# EAGLE design Home Assistant Relay 8 Channel V1.2 (EAGLE 6.1)

## Sheet 1 of 2
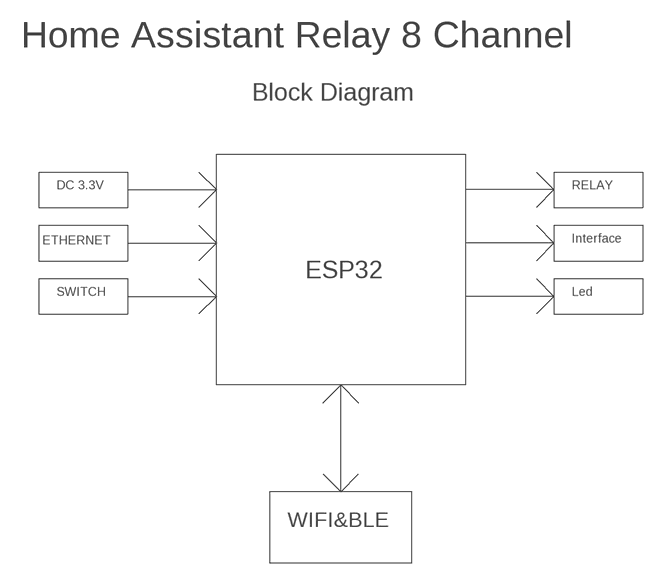
[diagram p0: schematic, sheet 1]

### Notes on the sheet
- Home Assistant Relay 8 Channel
- Block Diagram
- DC 3.3V | RELAY
- ETHERNET | Interface
- ESP32
- SWITCH | Led
- WIFI&BLE

## Sheet 2 of 2
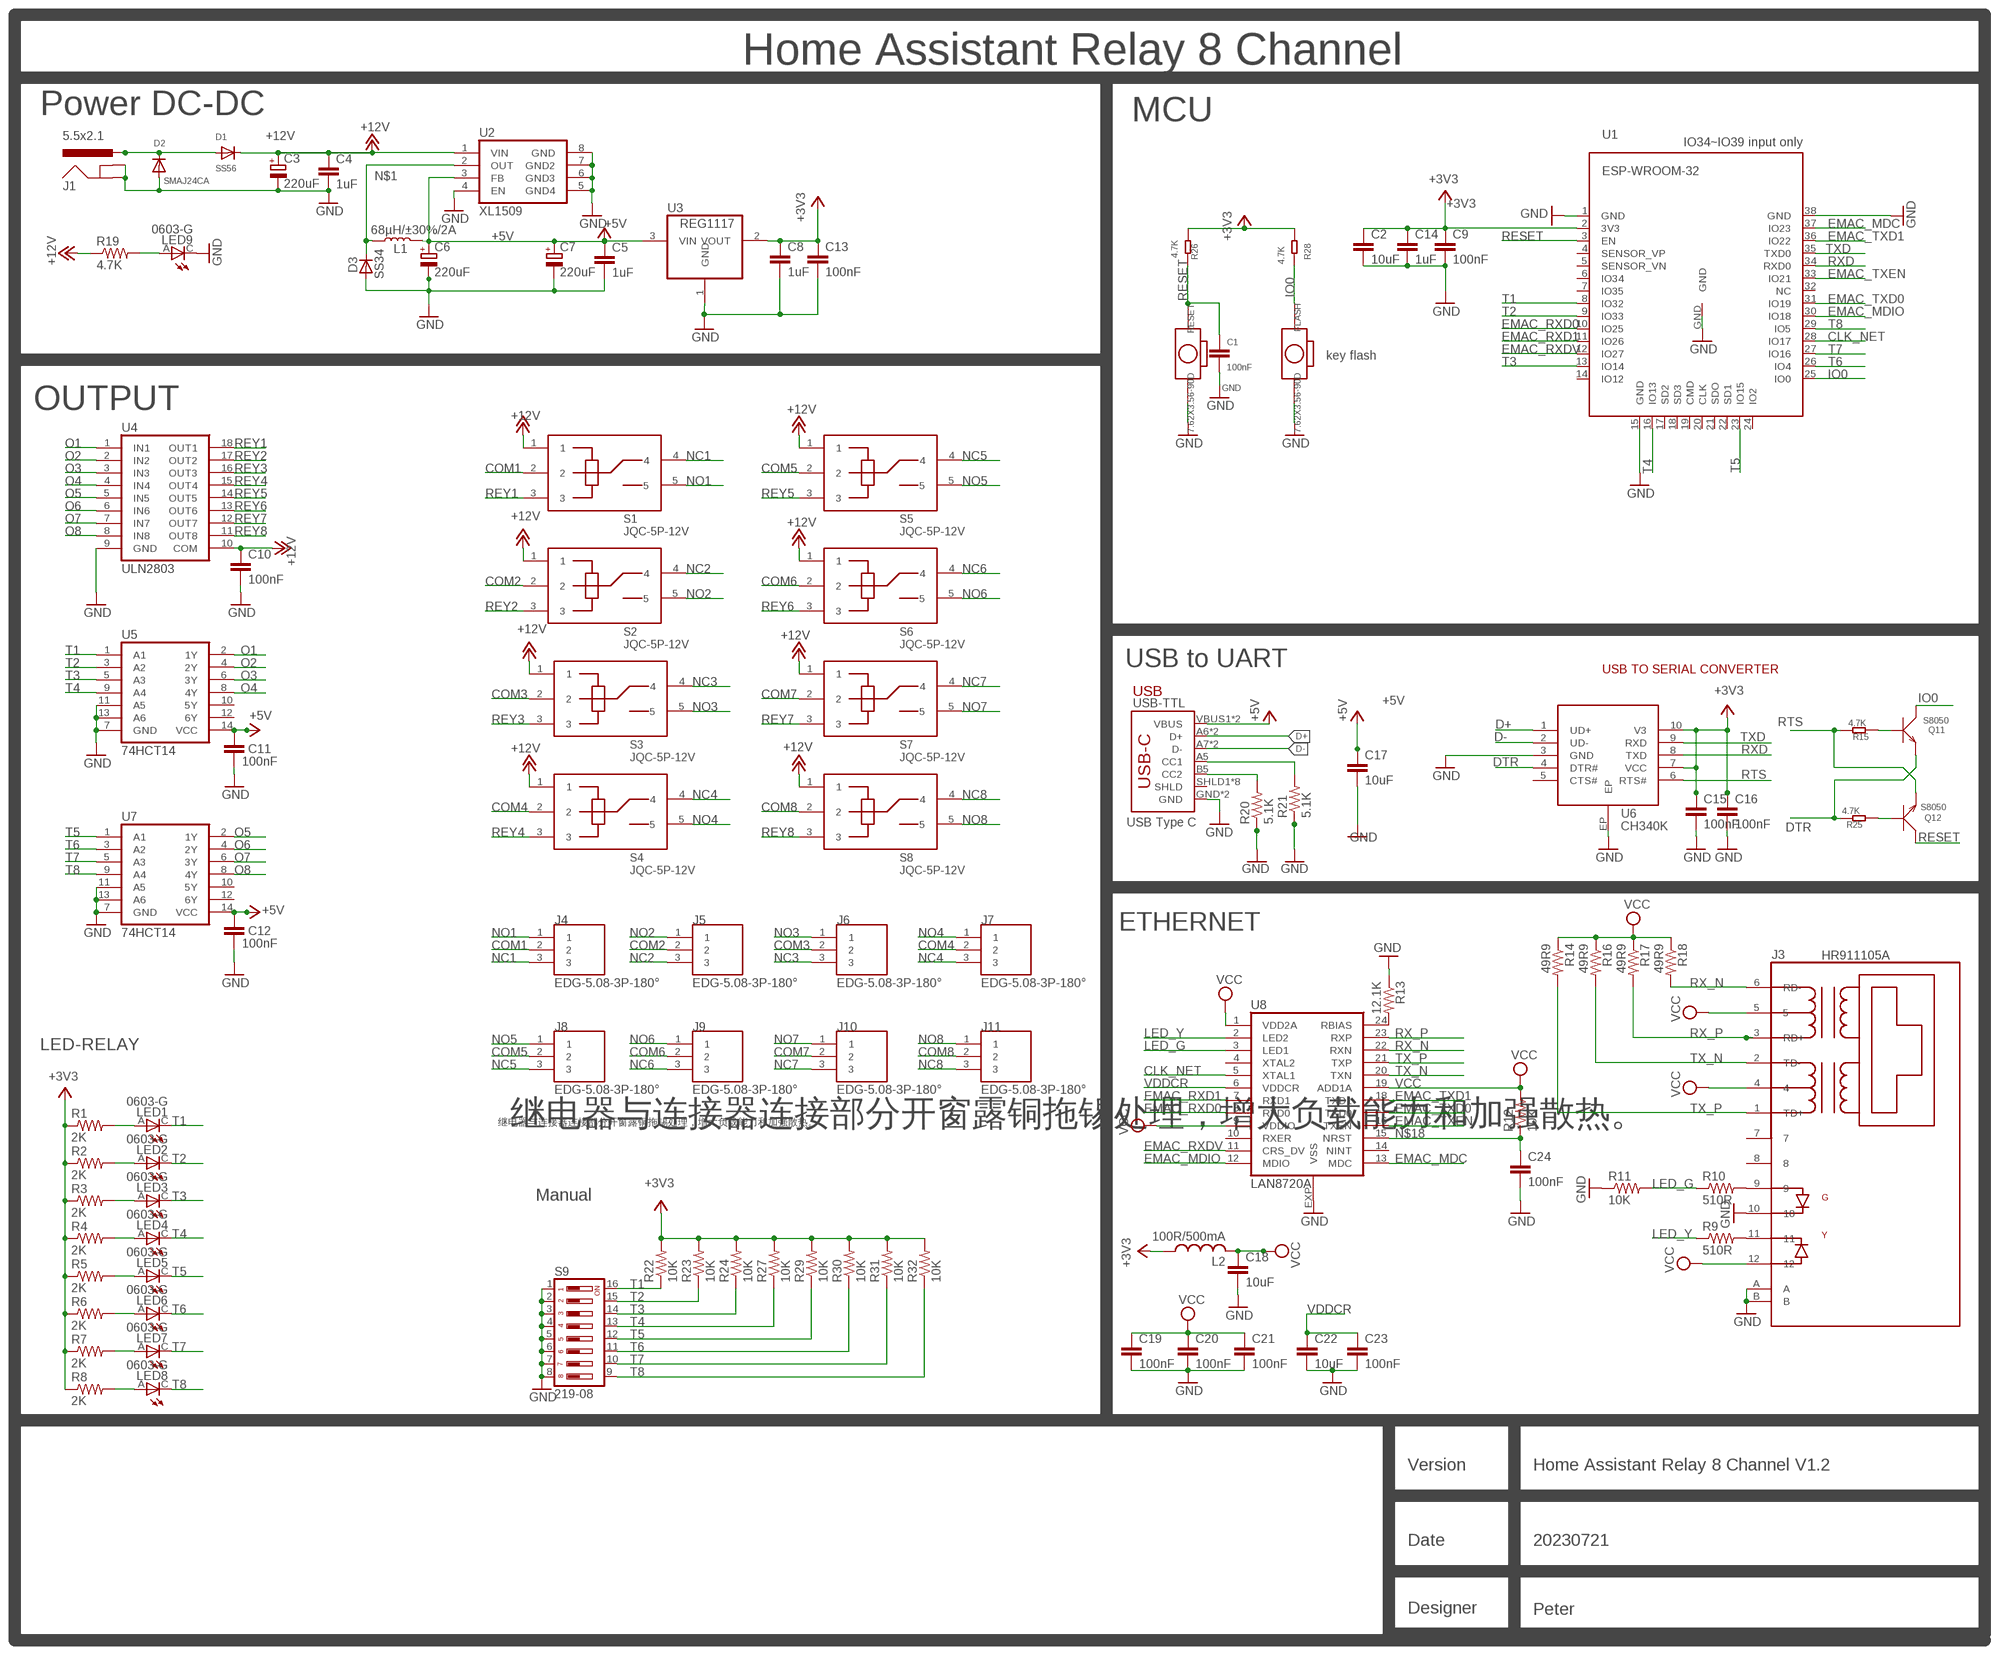
[diagram p1: schematic, sheet 2]

### Parts
C1  100nF  C0603  [C0603]
C2  10uF  C0603  [C0603]
C3  220uF  C-6.35  [SMD-6.3*5]
C4  1uF  C0603  [C0603]
C5  1uF  C0603  [C0603]
C6  220uF  C-6.35  [SMD-6.3*5]
C7  220uF  C-6.35  [SMD-6.3*5]
C8  1uF  C0603  [C0603]
C9  100nF  C0603  [C0603]
C10  100nF  C0603  [C0603]
C11  100nF  C0603  [C0603]
C12  100nF  C0603  [C0603]
C13  100nF  C0603  [C0603]
C14  1uF  C0603  [C0603]
C15  100nF  C0603  [C0603]
C16  100nF  C0603  [C0603]
C17  10uF  C0603  [C0603]
C18  10uF  C0603  [C0603]
C19  100nF  C0603  [C0603]
C20  100nF  C0603  [C0603]
C21  100nF  C0603  [C0603]
C22  10uF  C0603  [C0603]
C23  100nF  C0603  [C0603]
C24  100nF  C0603  [C0603]
D1  SS56  D-DO214  [DO-214]
D2  SMAJ24CA  D-DO214  [DO-214]
D3  SS34  DIODE-DO-214AC  [DO-214AC]
FLASH  7.62X3.56-90D  KEY-2P-7.62X3.56-90D  [2P-7.62X3.56-90D]
J1  5.5x2.1  POWER_JACKSMD  [POWER_JACK_SMD]
J3  HR911105A  [HR911105A]
J4  EDG-5.08-3P-180°  [EDG5.08MM-3P-180°]
J5  EDG-5.08-3P-180°  [EDG5.08MM-3P-180°]
J6  EDG-5.08-3P-180°  [EDG5.08MM-3P-180°]
J7  EDG-5.08-3P-180°  [EDG5.08MM-3P-180°]
J8  EDG-5.08-3P-180°  [EDG5.08MM-3P-180°]
J9  EDG-5.08-3P-180°  [EDG5.08MM-3P-180°]
J10  EDG-5.08-3P-180°  [EDG5.08MM-3P-180°]
J11  EDG-5.08-3P-180°  [EDG5.08MM-3P-180°]
L1  68µH/±30%/2A  INDUCTOR-CR54-3.3UH  [CR54]
L2  100R/500mA  L0603  [R0603]
LED1  0603-G  LED0603  [LED0603]
LED2  0603-G  LED0603  [LED0603]
LED3  0603-G  LED0603  [LED0603]
LED4  0603-G  LED0603  [LED0603]
LED5  0603-G  LED0603  [LED0603]
LED6  0603-G  LED0603  [LED0603]
LED7  0603-G  LED0603  [LED0603]
LED8  0603-G  LED0603  [LED0603]
LED9  0603-G  LED0603  [LED0603]
Q11  S8050  TRANSISTOR-NPN-SOT23  [SOT23]
Q12  S8050  TRANSISTOR-NPN-SOT23  [SOT23]
R1  2K  R0603  [R0603]
R2  2K  R0603  [R0603]
R3  2K  R0603  [R0603]
R4  2K  R0603  [R0603]
R5  2K  R0603  [R0603]
R6  2K  R0603  [R0603]
R7  2K  R0603  [R0603]
R8  2K  R0603  [R0603]
R9  510R  R0603  [R0603]
R10  510R  R0603  [R0603]
R11  10K  R0603  [R0603]
R12  10K  R0603  [R0603]
R13  12.1K  R0603  [R0603]
R14  49R9  R0603  [R0603]
R15  4.7K  R-0603  [R0603]
R16  49R9  R0603  [R0603]
R17  49R9  R0603  [R0603]
R18  49R9  R0603  [R0603]
R19  4.7K  R0603  [R0603]
R20  5.1K  R0603  [R0603]
R21  5.1K  R0603  [R0603]
R22  10K  R0603  [R0603]
R23  10K  R0603  [R0603]
R24  10K  R0603  [R0603]
R25  4.7K  R-0603  [R0603]
R26  4.7K  R-0603  [R0603]
R27  10K  R0603  [R0603]
R28  4.7K  R-0603  [R0603]
R29  10K  R0603  [R0603]
R30  10K  R0603  [R0603]
R31  10K  R0603  [R0603]
R32  10K  R0603  [R0603]
RESET  7.62X3.56-90D  KEY-2P-7.62X3.56-90D  [2P-7.62X3.56-90D]
S1  JQC-5P-12V  JQC-5P-3.3V  [JQC-5P-5V]
S2  JQC-5P-12V  JQC-5P-3.3V  [JQC-5P-5V]
S3  JQC-5P-12V  JQC-5P-3.3V  [JQC-5P-5V]
S4  JQC-5P-12V  JQC-5P-3.3V  [JQC-5P-5V]
S5  JQC-5P-12V  JQC-5P-3.3V  [JQC-5P-5V]
S6  JQC-5P-12V  JQC-5P-3.3V  [JQC-5P-5V]
S7  JQC-5P-12V  JQC-5P-3.3V  [JQC-5P-5V]
S8  JQC-5P-12V  JQC-5P-3.3V  [JQC-5P-5V]
S9  219-08  [CTS-219-08]
U1  ESP-WROOM-32  [ESP-WROOM-32]
U2  XL1509  [SOP8]
U3  REG1117  [SOT223]
U4  ULN2803  [MSOP18]
U5  74HCT14  [SO14]
U6  CH340K  [ESOP-10-EP-150MIL]
U7  74HCT14  [SO14]
U8  LAN8720A  [QFN24-4X4]
USB-TTL  USB_C5  [USB-C-16P-5]

### Nets
+3V3: C2.1 C8.1 C9.1 C13.1 C14.1 C15.1 C16.1 L2.1 R1.1 R2.1 R3.1 R4.1 R5.1 R6.1 R7.1 R8.1 R22.2 R23.2 R24.2 R26.2 R27.2 R28.2 R29.2 R30.2 R31.2 R32.2 U1.2(3V3) U3.2(VOUT) U6.7(VCC) U6.10(V3)
+5V: C5.1 C6.+ C7.+ C11.1 C12.1 C17.1 L1.P$2 U2.3(FB) U3.3(VIN) U5.14(VCC) U7.14(VCC) USB-TTL.VBUS1(VBUS) USB-TTL.VBUS2(VBUS)
+12V: C3.+ C4.1 C10.1 D1.C R19.1 S1.1 S2.1 S3.1 S4.1 S5.1 S6.1 S7.1 S8.1 U2.1(VIN) U4.10(COM)
CLK_NET: U1.28(IO17) U8.5(XTAL1)
COM1: J4.2 S1.2
COM2: J5.2 S2.2
COM3: J6.2 S3.2
COM4: J7.2 S4.2
COM5: J8.2 S5.2
COM6: J9.2 S6.2
COM7: J10.2 S7.2
COM8: J11.2 S8.2
D+: U6.1(UD+) USB-TTL.A6(D+) USB-TTL.B6(D+)
D-: U6.2(UD-) USB-TTL.A7(D-) USB-TTL.B7(D-)
DTR: Q11.2(E) R25.1 U6.4(DTR#)
EMAC_MDC: U1.37(IO23) U8.13(MDC)
EMAC_MDIO: U1.30(IO18) U8.12(MDIO)
EMAC_RXD0: U1.10(IO25) U8.8(RXD0)
EMAC_RXD1: U1.11(IO26) U8.7(RXD1)
EMAC_RXDV: U1.12(IO27) U8.11(CRS_DV)
EMAC_TXD0: U1.31(IO19) U8.17(TXD0)
EMAC_TXD1: U1.36(IO22) U8.18(TXD1)
EMAC_TXEN: U1.33(IO21) U8.16(TXEN)
GND: C1.2 C2.2 C3.- C4.2 C5.2 C6.- C7.- C8.2 C9.2 C10.2 C11.2 C12.2 C13.2 C14.2 C15.2 C16.2 C17.2 C18.2 C19.2 C20.2 C21.2 C22.2 C23.2 C24.2 D2.A D3.A FLASH.P$2 J1.GND(GNDBREAK) J1.P$4(GND) J3.10 J3.A J3.B LED9.C R11.1 R13.1 R20.1 R21.1 RESET.P$2 S9.1 S9.2 S9.3 S9.4 S9.5 S9.6 S9.7 S9.8 U1.1(GND) U1.15(GND) U1.38(GND) U1.GND U2.4(EN) U2.5(GND4) U2.6(GND3) U2.7(GND2) U2.8(GND) U3.1(GND) U4.9(GND) U5.7(GND) U5.11(A5) U5.13(A6) U6.3(GND) U6.EP U7.7(GND) U7.11(A5) U7.13(A6) U8.EXP(VSS) USB-TTL.GND USB-TTL.GND2(GND)
IO0: FLASH.P$1 Q11.3(C) R28.1 U1.25(IO0)
LED_G: R10.1 R11.2 U8.3(LED1)
LED_Y: R9.1 U8.2(LED2)
N$1: D3.C L1.P$1 U2.2(OUT)
N$2: LED1.A R1.2
N$4: LED2.A R2.2
N$5: LED3.A R3.2
N$6: LED4.A R4.2
N$7: LED5.A R5.2
N$8: Q12.1(B) R25.2
N$9: Q11.1(B) R15.2
N$11: LED6.A R6.2
N$12: LED7.A R7.2
N$13: LED8.A R8.2
N$14: J3.11 R9.2
N$15: J3.9 R10.2
N$17: R13.2 U8.24(RBIAS)
N$18: C24.1 R12.1 U8.15(NRST)
N$19: D1.A D2.C J1.VIN0(PWR)
N$20: LED9.A R19.2
N$21: R21.2 USB-TTL.A5(CC1)
N$22: R20.2 USB-TTL.B5(CC2)
NC1: J4.3 S1.4
NC2: J5.3 S2.4
NC3: J6.3 S3.4
NC4: J7.3 S4.4
NC5: J8.3 S5.4
NC6: J9.3 S6.4
NC7: J10.3 S7.4
NC8: J11.3 S8.4
NO1: J4.1 S1.5
NO2: J5.1 S2.5
NO3: J6.1 S3.5
NO4: J7.1 S4.5
NO5: J8.1 S5.5
NO6: J9.1 S6.5
NO7: J10.1 S7.5
NO8: J11.1 S8.5
O1: U4.1(IN1) U5.2(1Y)
O2: U4.2(IN2) U5.4(2Y)
O3: U4.3(IN3) U5.6(3Y)
O4: U4.4(IN4) U5.8(4Y)
O5: U4.5(IN5) U7.2(1Y)
O6: U4.6(IN6) U7.4(2Y)
O7: U4.7(IN7) U7.6(3Y)
O8: U4.8(IN8) U7.8(4Y)
RESET: C1.1 Q12.3(C) R26.1 RESET.P$1 U1.3(EN)
REY1: S1.3 U4.18(OUT1)
REY2: S2.3 U4.17(OUT2)
REY3: S3.3 U4.16(OUT3)
REY4: S4.3 U4.15(OUT4)
REY5: S5.3 U4.14(OUT5)
REY6: S6.3 U4.13(OUT6)
REY7: S7.3 U4.12(OUT7)
REY8: S8.3 U4.11(OUT8)
RTS: Q12.2(E) R15.1 U6.6(RTS#)
RX_N: J3.6(RD-) R18.2 U8.22(RXN)
RX_P: J3.3(RD+) R17.2 U8.23(RXP)
RXD: U1.34(RXD0) U6.8(TXD)
T1: LED1.C R22.1 S9.16 U1.8(IO32) U5.1(A1)
T2: LED2.C R23.1 S9.15 U1.9(IO33) U5.3(A2)
T3: LED3.C R24.1 S9.14 U1.13(IO14) U5.5(A3)
T4: LED4.C R27.1 S9.13 U1.16(IO13) U5.9(A4)
T5: LED5.C R29.1 S9.12 U1.23(IO15) U7.1(A1)
T6: LED6.C R30.1 S9.11 U1.26(IO4) U7.3(A2)
T7: LED7.C R31.1 S9.10 U1.27(IO16) U7.5(A3)
T8: LED8.C R32.1 S9.9 U1.29(IO5) U7.9(A4)
TX_N: J3.2(TD-) R16.2 U8.20(TXN)
TX_P: J3.1(TD+) R14.2 U8.21(TXP)
TXD: U1.35(TXD0) U6.9(RXD)
VCC: C18.1 C19.1 C20.1 C21.1 J3.4 J3.5 J3.12 L2.2 R12.2 R14.1 R16.1 R17.1 R18.1 U8.1(VDD2A) U8.9(VDDIO) U8.19(ADD1A)
VDDCR: C22.1 C23.1 U8.6(VDDCR)
Unconnected: J3.7 J3.8 U1.4(SENSOR_VP) U1.5(SENSOR_VN) U1.6(IO34) U1.7(IO35) U1.14(IO12) U1.17(SD2) U1.18(SD3) U1.19(CMD) U1.20(CLK) U1.21(SDO) U1.22(SD1) U1.24(IO2) U1.32(NC) U5.10(5Y) U5.12(6Y) U6.5(CTS#) U7.10(5Y) U7.12(6Y) U8.4(XTAL2) U8.10(RXER) U8.14(NINT) USB-TTL.SHLD1(SHLD) USB-TTL.SHLD2(SHLD) USB-TTL.SHLD3(SHLD) USB-TTL.SHLD4(SHLD) USB-TTL.SHLD5(SHLD) USB-TTL.SHLD6(SHLD) USB-TTL.SHLD7(SHLD) USB-TTL.SHLD8(SHLD)

### Notes on the sheet
- Home Assistant Relay 8 Channel
- Power DC-DC | MCU
- IO34~IO39 input only
- key flash
- OUTPUT
- USB to UART
- USB TO SERIAL CONVERTER
- USB
- USB Type C
- ETHERNET
- LED-RELAY
- 继电器与连接器连接部分开窗露铜拖锡处理，增大负载能力和加强散热。 | 继电器与连接器连接部分开窗露铜拖锡处理，增大负载能力和加强散热。
- Manual
- Version | Home Assistant Relay 8 Channel V1.2
- Date | 20230721
- Designer | Peter

## Library data of the parts
C1 C2 C4 C5 C8-C24 = Makerfabs-Peter:C0603
C3 C6 C7 = Makerfabs-Peter:C-6.3*5
D1 D2 = Makerfabs-Peter:D-DO214
D3 = diode:DIODE-: DIODE
FLASH RESET = Makerfabs-Peter:KEY-2P-7.62X3.56-90D
J1 = SparkFun-Connectors:POWER_JACK: Power Jack Connector This is the standard 5.5mm barrel jack for power. The PTH is the most common, proven, reliable, footprint. The Slot footprint only works if the mill layer is transmitted to the PCB fab house so be warned. Here are the connectors we sell at SparkFun: DC Barrel Power Jack/Connector <https://www.sparkfun.com/products/119> (PRT-00119) DC Barrel Power Jack/Connector (SMD) <https://www.sparkfun.com/products/12748> (PRT-12748) DC Barrel Jack Adapter - Breadboard Compatible <https://www.sparkfun.com/products/10811> (PRT-10811) It is used on this SparkFun product (and many, many others): SparkFun RedBoard - Programmed with Arduino <https://www.sparkfun.com/products/12757> (DEV-12757) Also, if you need a mating power supply or connector, please check these out: Wall Adapter Power Supply - 9VDC 650mA <https://www.sparkfun.com/products/298> (TOL-00298) DC Barrel Jack Adapter - Male <https://www.sparkfun.com/products/10287> (PRT-10287); PROD_ID: CONN-08106; SF_ID: PRT-12748; VALUE: 5.5x2.1mm Barrel
J3 = Makerfabs-Peter:HR911105A
J4-J11 = Makerfabs-Peter:EDG-5.08-3P-180°
L1 = SparkFun-Coils:INDUCTOR: Inductors Resist changes in electrical current. Basically a coil of wire. SparkFun Products: SparkFun Load Cell Amplifier - HX711 <https://www.sparkfun.com/products/13879> IOIO-OTG - V2.2 <https://www.sparkfun.com/products/13613>; PROD_ID: NDUC-11157; VALUE: 3.3µH/±30%/3.4A
L2 = Makerfabs-Peter:L0603
LED1-LED9 = Makerfabs-Peter:LED0603
Q11 Q12 = Discrete:TRANSISTOR-NPN*: NPN audion
R1-R14 R16-R24 R27 R29-R32 = Makerfabs-Peter:R0603
R15 R25 R26 R28 = Discrete:R*
S1-S8 = Makerfabs-Peter:JQC-5P-3.3V
S9 = Makerfabs-Peter:219-08*: Surface Mount DIP Switch Series 219 SMT CTS Electronic Components Sourc: www.ctscorp.com; OC_FARNELL: unknown; OC_NEWARK: unknown
U1 = esp32:ESP-WROOM-32
U2 = Makerfabs-Peter:XL1509
U3 = burr-brown:REG1117: 800mA and 1A Low Dropout (LDO) Positive Regulator 1.8V, 2.5V, 2.85V, 3.3V, 5V, and Adj; MPN: REG1117; OC_FARNELL: 1097566; OC_NEWARK: 14P6981
U4 = Makerfabs-Peter:ULN2803
U5 U7 = Makerfabs-Peter:74HCT14
U6 = sale:CH340K
U8 = Makerfabs-Peter:LAN8720A
USB-TTL = USBC:USB_C: USB Type C 16Pin Connector Super Speed pins not available on the 16-pin purely SMD connector so this part is best for USB 2.0 implementations. D1 and D2 are tied together enabling D+/- no matter which way the cable is plugged into the connector. The two channel configuration pins (CC1/2) are exposed. These are normally connected to ground via 5.1k resistors but can be reconfigured for high current/high power applications.

## Net classes
0 default: width 0.152 mm, drill 0.254 mm, clearance 0.152 mm

## Board
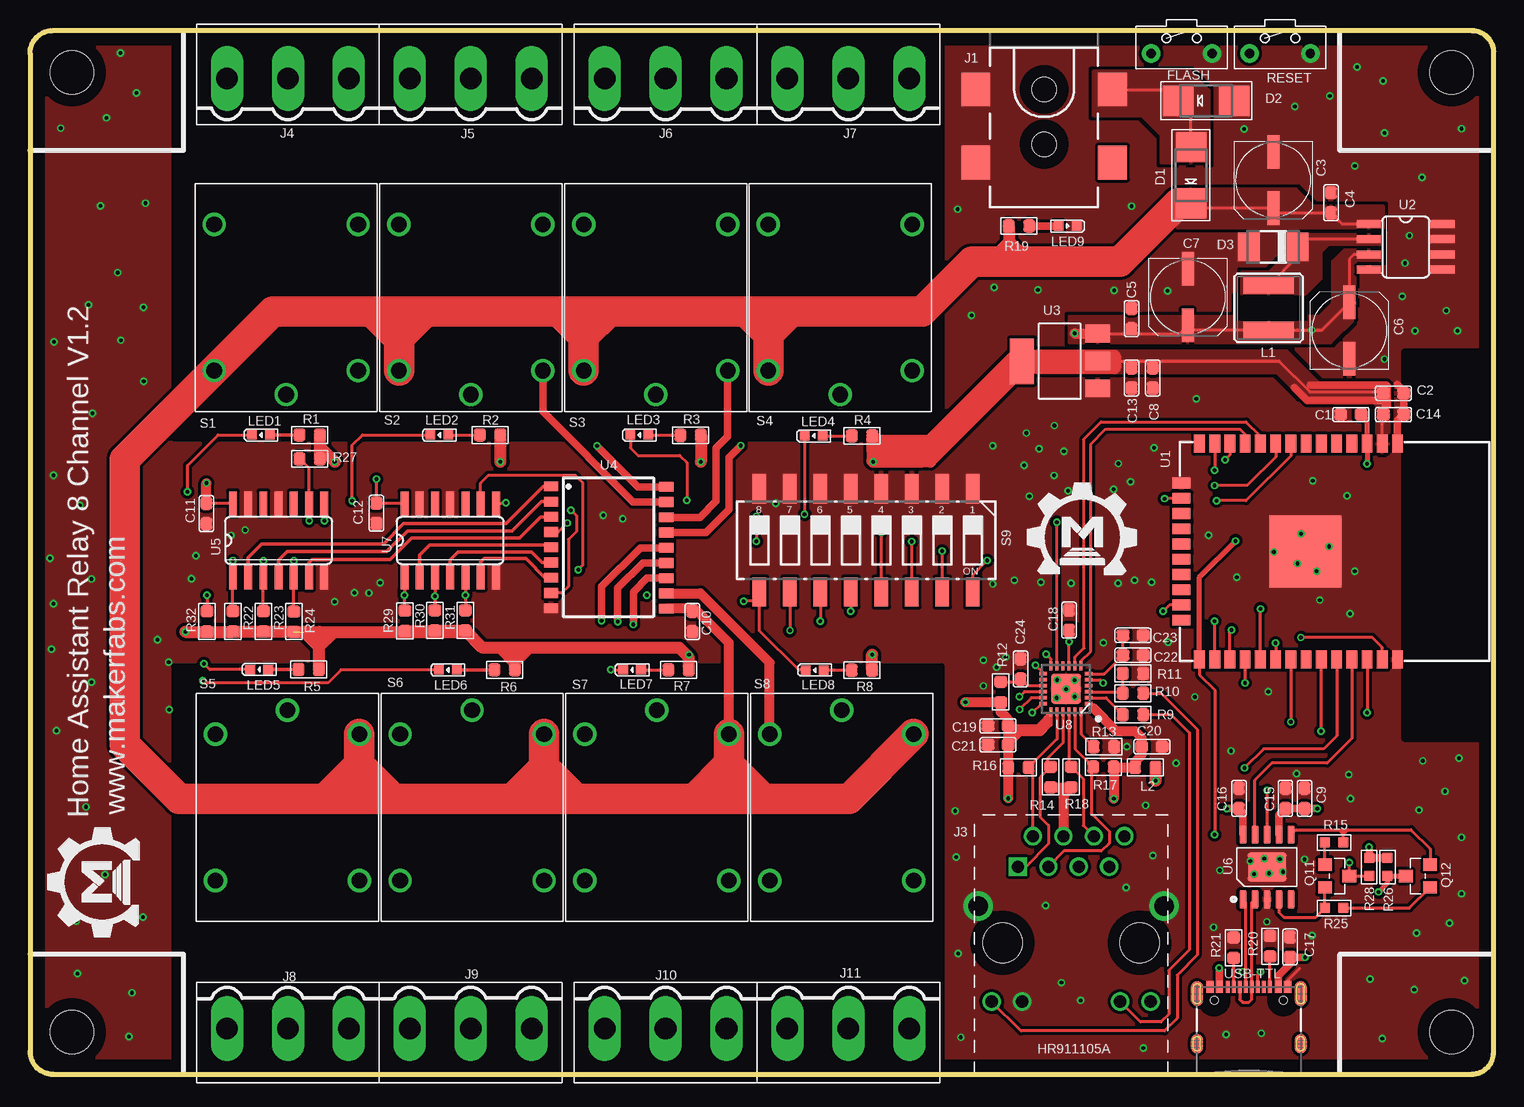
[diagram p2: board, top side]
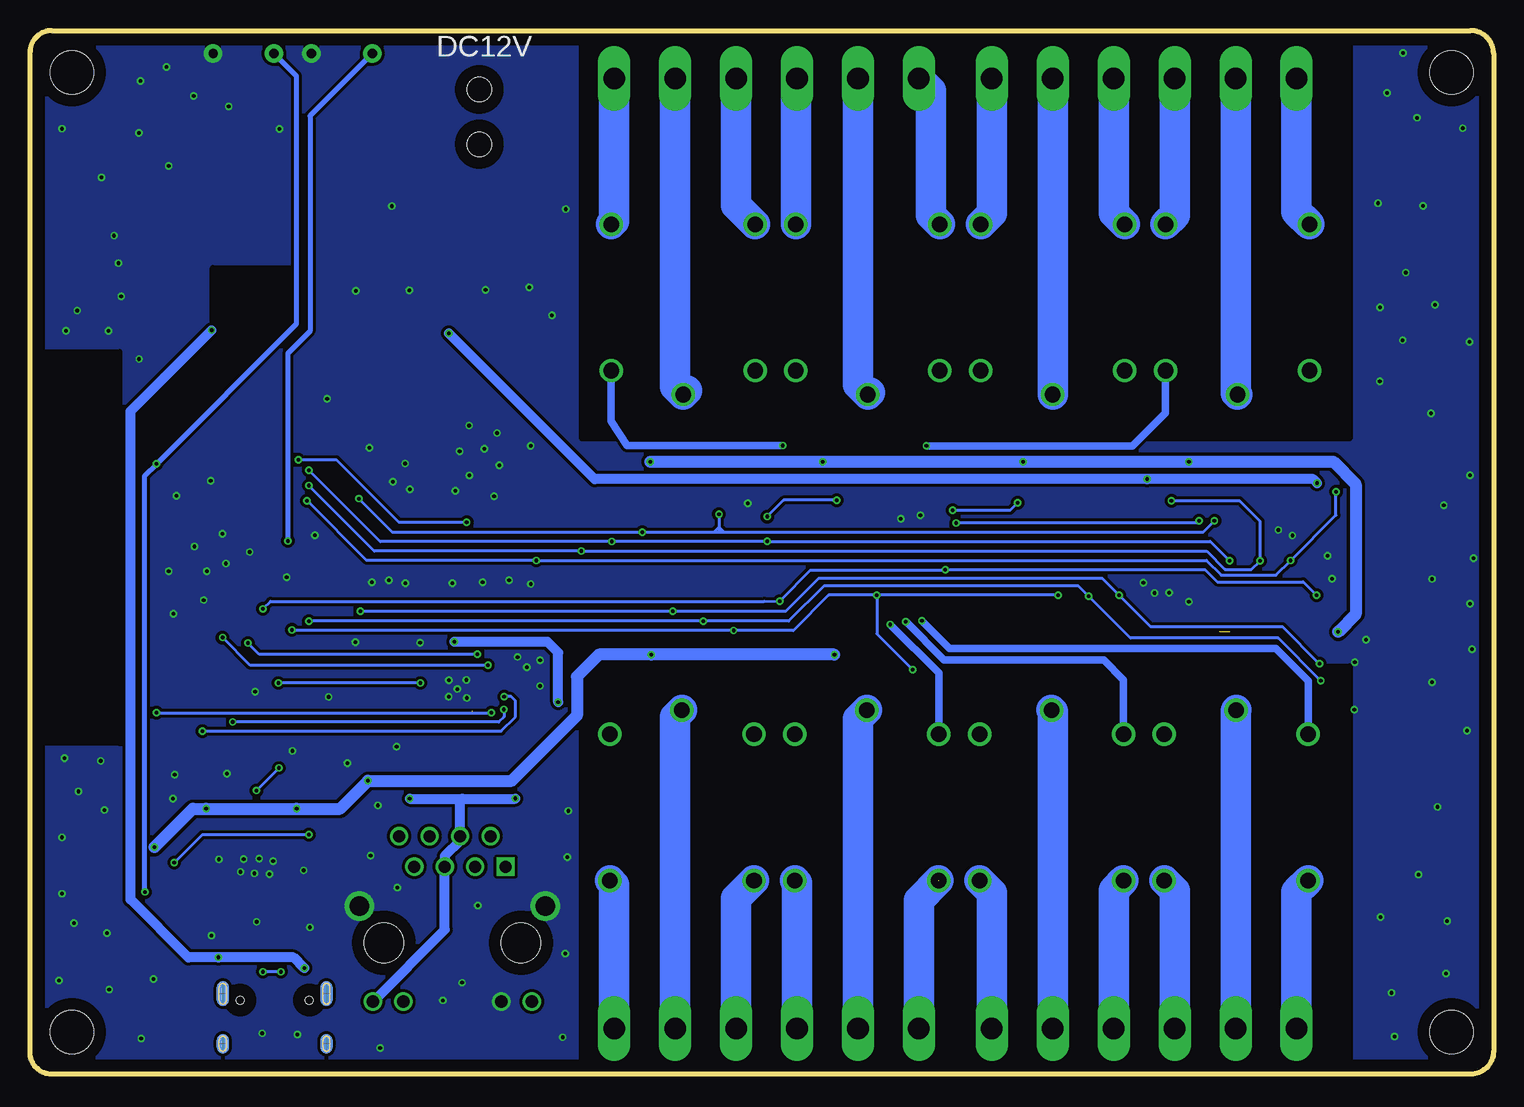
[diagram p3: board, bottom side, seen from below]

Size 122 x 87 mm. Coordinates in mm from the lower left corner, seen from the top.
Outline: 1.9,0 120.2,0 arc90 122,1.8 122,85.2 arc90 120.2,87 1.9,87 arc90 0,85.1 0,1.9 arc90 1.9,0
Copper layers (1*16): Top 0.035mm / dielectric 1.5mm / Bottom 0.035mm
Design rules: minimum track width 10mil, minimum drill 10mil, track to track 8mil, track to pad 8mil, pad to pad 8mil, via to via 8mil, smd to smd 0mil, copper to edge 40mil, drill to drill 8mil, minimum pad ring 10mil, minimum via ring 6mil, stop-mask expansion 4mil, vias tented up to drill 0mil, thermal gap 0mil
Holes 3.6 mm at 3.5,3.5 118.5,3.5 118.5,83.5 3.5,83.5
tRestrict: area 114.5,28 to 122,60.2; area 100.4,62.8 to 106.5,64.9; area 12,0 to 76,34; area 12,53 to 76,87
bRestrict: area 114.6,27.6 to 122.2,60.2; area 100.2,60.9 to 106.8,67.2; area 12,53 to 76,87; area 12,0 to 76,34

### Footprints (pad centres in the part's own frame; a part is rotated, then mirrored left to right if it is on the bottom)
C0603 = smd 1.1 x 1: 1 -0.85,0; 2 0.85,0
SMD-6.3*5 = smd 2.8 x 1: + 2.35,0; - -2.35,0
DO-214 = smd 2.54 x 2.54: A 2.349,0; C -2.349,0
DO-214AC = smd 1.8 x 2.4: A 2.025,0; C -2.025,0
2P-7.62X3.56-90D = drill 0.762 pad 1.524: P$1 -2.54,0; P$2 2.54,0
POWER_JACK_SMD = smd 2.8 x 2.4: GND 0,-5.7; P$4 6.1,-5.7; VIN0 0,5.7; VIN1 6.1,5.7 | hole 2.032: 0,0; 4.572,0
HR911105A = drill 1 square: 1 4.45,-6.35 | drill 1: 2 3.18,-8.89; 3 1.91,-6.35; 4 0.64,-8.89; 5 -0.63,-6.35; 6 -1.9,-8.89; 7 -3.17,-6.35; 8 -4.44,-8.89 | drill 1.02: 9 6.625,4.9; 10 4.085,4.9; 11 -4.085,4.9; 12 -6.625,4.9 | drill 1.65: A -7.745,-3.05; B 7.745,-3.05 | hole 3.3: 5.71,0; -5.71,0
EDG5.08MM-3P-180° = drill 1.8 pad 2.54 long: 1 5.08,0; 2 0,0; 3 -5.08,0
CR54 = smd 4.2 x 1.4: P$1 0,1.85; P$2 0,-1.85
R0603 = smd 1 x 1.1: 1 -0.85,0; 2 0.85,0
LED0603 = smd 0.8 x 0.8: A -0.75,0; C 0.75,0
SOT23 = smd 1.016 x 1.143: 1 -0.95,-1.016; 2 0.95,-1.016; 3 0,1.016
R0603' = smd 0.889 x 0.889: 1 -0.762,0; 2 0.762,0
JQC-5P-5V = drill 1.3: 1 -6.35,5.65; 2 -8.35,-0.35; 3 -6.35,-6.35; 4 5.85,5.65; 5 5.85,-6.35
CTS-219-08 = smd 1.13 x 2.44: 1 -8.89,-4.3; 2 -6.35,-4.3; 3 -3.81,-4.3; 4 -1.27,-4.3; 5 1.27,-4.3; 6 3.81,-4.3; 7 6.35,-4.3; 8 8.89,-4.3; 9 8.89,4.3; 10 6.35,4.3; 11 3.81,4.3; 12 1.27,4.3; 13 -1.27,4.3; 14 -3.81,4.3; 15 -6.35,4.3; 16 -8.89,4.3
ESP-WROOM-32 = smd 0.9 x 1.5: 1 7.7,9; 2 6.43,9; 3 5.16,9; 4 3.89,9; 5 2.62,9; 6 1.35,9; 7 0.08,9; 8 -1.19,9; 9 -2.46,9; 10 -3.73,9; 11 -5,9; 12 -6.27,9; 13 -7.54,9; 14 -8.81,9; 25 -8.81,-9; 26 -7.54,-9; 27 -6.27,-9; 28 -5,-9; 29 -3.73,-9; 30 -2.46,-9; 31 -1.19,-9; 32 0.08,-9; 33 1.35,-9; 34 2.62,-9; 35 3.89,-9; 36 5.16,-9; 37 6.43,-9; 38 7.7,-9 | smd 1.5 x 0.9: 15 -10.3,5.715; 16 -10.3,4.445; 17 -10.3,3.175; 18 -10.3,1.905; 19 -10.3,0.635; 20 -10.3,-0.635; 21 -10.3,-1.905; 22 -10.3,-3.175; 23 -10.3,-4.445; 24 -10.3,-5.715 | smd 6 x 6: GND 0,0
SOP8 = smd 0.66 x 2.032: 1 -1.905,-3.073; 2 -0.635,-3.073; 3 0.635,-3.073; 4 1.905,-3.073; 5 1.905,3.073; 6 0.635,3.073; 7 -0.635,3.073; 8 -1.905,3.073
SOT223 = smd 1.499 x 2.007: 1 -2.261,-3.15; 2 0.025,-3.15; 3 2.311,-3.15 | smd 3.81 x 2.007: 4 0,3.15
MSOP18 = smd 0.8 x 1.2: 1 -5.62,-4.85; 2 -4.35,-4.85; 3 -3.08,-4.85; 4 -1.81,-4.85; 5 -0.54,-4.85; 6 0.73,-4.85; 7 2,-4.85; 8 3.27,-4.85; 9 4.54,-4.85; 10 4.58,4.74; 11 3.31,4.74; 12 2.04,4.74; 13 0.77,4.74; 14 -0.5,4.74; 15 -1.77,4.74; 16 -3.04,4.74; 17 -4.31,4.74; 18 -5.58,4.74
SO14 = smd 0.66 x 2.032: 1 -4.445,-3.073; 2 -3.175,-3.073; 3 -1.905,-3.073; 4 -0.635,-3.073; 5 0.635,-3.073; 6 1.905,-3.073; 7 3.175,-3.073; 8 3.175,3.073; 9 1.905,3.073; 10 0.635,3.073; 11 -0.635,3.073; 12 -1.905,3.073; 13 -3.175,3.073; 14 -4.445,3.073
ESOP-10-EP-150MIL = smd 1.5 x 0.6: 1 -2.7,2; 2 -2.7,1; 3 -2.7,0; 4 -2.7,-1; 5 -2.7,-2; 6 2.7,-2; 7 2.7,-1; 8 2.7,0; 9 2.7,1; 10 2.7,2 | smd 2.4 x 3.2: EP 0,0
QFN24-4X4 = smd 0.7 x 0.28: 1 -1.9,1.25; 2 -1.9,0.75; 3 -1.9,0.25; 4 -1.9,-0.25; 5 -1.9,-0.75; 6 -1.9,-1.25; 13 1.9,-1.25; 14 1.91,-0.75; 15 1.91,-0.25; 16 1.91,0.25; 17 1.91,0.75; 18 1.91,1.25 | smd 0.28 x 0.7: 7 -1.25,-1.9; 8 -0.75,-1.9; 9 -0.25,-1.9; 10 0.25,-1.9; 11 0.75,-1.9; 12 1.25,-1.9; 19 1.25,1.91; 20 0.75,1.91; 21 0.25,1.91; 22 -0.25,1.91; 23 -0.75,1.91; 24 -1.25,1.91 | smd 2.5 x 2.5: EXP 0,0
USB-C-16P-5 = smd 0.3 x 1: A5 -1.25,-0.34; A6 -0.25,-0.34; A7 0.25,-0.34; A8 1.25,-0.34; B5 1.75,-0.34; B6 0.75,-0.34; B7 -0.75,-0.34; B8 -1.75,-0.34 | smd 0.6 x 1: GND -3.225,-0.34; GND2 3.225,-0.34; VBUS1 -2.45,-0.34; VBUS2 2.45,-0.34 | smd 1 x 2.1: SHLD1 -4.32,-0.915; SHLD2 4.32,-0.915 | smd 1 x 2.1 bottom: SHLD3 -4.32,-0.915; SHLD4 4.32,-0.915 | smd 1 x 1.6: SHLD5 -4.32,-5.095; SHLD8 4.32,-5.095 | smd 1 x 1.6 bottom: SHLD6 -4.32,-5.095; SHLD7 4.32,-5.095 | hole 0.65: -2.89,-1.445; 2.89,-1.445

### Placement (x,y rotation side)
C1  110.11,54.99 180 top
C2  113.67,56.77 0 top
C3  103.63,74.55 270 top
C4  108.46,72.64 90 top
C5  91.82,62.99 90 top
C6  109.98,61.98 90 top
C7  96.52,64.77 270 top
C8  93.6,58.04 270 top
C9  106.25,22.99 90 top
C10  55.22,37.74 270 top
C11  14.71,46.74 270 top
C12  28.88,46.76 270 top
C13  91.82,58.04 270 top
C14  113.67,54.99 0 top
C15  104.65,22.99 90 top
C16  100.79,22.99 90 top
C17  105.03,10.59 90 top
C18  86.61,37.85 90 top
C19  80.7,29.03 180 top
C20  93.52,27.3 0 top
C21  80.7,27.46 180 top
C22  91.95,34.92 0 top
C23  91.95,36.58 0 top
C24  82.58,33.78 90 top
D1  96.77,74.93 90 top
D2  98.04,81.15 0 top
D3  103.63,68.96 180 top
FLASH  96,85.09 0 top
J1  84.54,82.09 270 top
J3  86.79,10.95 180 top
J4  21.5,83 0 top
J5  36.74,83 0 top
J6  52.98,83 0 top
J7  68.22,83 0 top
J8  21.5,3.81 180 top
J9  36.74,3.81 180 top
J10  52.98,3.81 180 top
J11  68.22,3.81 180 top
L1  103.25,63.88 0 top
L2  92.96,25.58 180 top
LED1  19.25,53.29 180 top
LED2  34.11,53.29 180 top
LED3  50.8,53.29 180 top
LED4  65.33,53.21 180 top
LED5  19.1,33.73 180 top
LED6  34.82,33.71 180 top
LED7  50.19,33.71 180 top
LED8  65.43,33.68 180 top
LED9  86.49,70.71 0 top
Q11  108.97,16.51 270 top
Q12  115.7,16.51 90 top
R1  23.32,53.29 180 top
R2  38.35,53.29 180 top
R3  55.07,53.26 180 top
R4  69.37,53.21 180 top
R5  23.24,33.73 180 top
R6  39.57,33.71 180 top
R7  54.08,33.71 180 top
R8  69.34,33.68 180 top
R9  91.95,29.97 0 top
R10  91.95,31.75 0 top
R11  91.95,33.4 180 top
R12  80.92,31.85 270 top
R13  89.51,27.3 180 top
R14  85.09,24.77 90 top
R15  4.7K  [R0603']  108.71,19.3 180 top
R16  82.4,25.58 0 top
R17  89.48,25.6 180 top
R18  86.79,24.77 90 top
R19  82.45,70.71 0 top
R20  103.38,10.67 270 top
R21  100.33,10.54 270 top
R22  16.92,37.74 270 top
R23  19.46,37.74 270 top
R24  22,37.72 270 top
R25  4.7K  [R0603']  108.71,13.84 0 top
R26  4.7K  [R0603']  113.16,17.27 90 top
R27  23.32,51.31 0 top
R28  4.7K  [R0603']  111.63,17.27 90 top
R29  31.24,37.8 270 top
R30  33.76,37.82 270 top
R31  36.3,37.82 270 top
R32  14.76,37.74 270 top
RESET  104.2,85.09 0 top
S1  21,65 90 top
S2  36.4,65 90 top
S3  51.8,65 90 top
S4  67.2,65 90 top
S5  21.8,22 270 top
S6  37.2,22 270 top
S7  52.6,22 270 top
S8  68,22 270 top
S9  69.7,44.5 180 top
U1  106.3,43.56 0 top
U2  114.68,68.96 270 top
U3  85.85,59.44 90 top
U4  48.29,43.38 270 top
U5  21.36,44.5 0 top
U6  103.12,17.27 90 top
U7  35.66,44.5 0 top
U8  86.36,32.13 180 top
U$1  [MAKERFABS_0.3]  9.09,11.89 90 top
U$2  [MAKERFABS_0.3]  83.6,41.69 0 top
USB-TTL  101.6,7.62 0 top

### Tracks (layer width: path | path; a pad name or v marks a point on that pad's centre or on a via)
+3V3  (via drill 0.3)  (1 unrouted)
  Top 0.254: U3.2 91.82,59.46 | 91.82,59.46 93.98,59.46 | 93.98,59.46 104.11,59.46 106.68,56.9 112.69,56.9 C2.1 C14.1 112.73,54.91 U1.2 | C13.1 91.82,59.46 | C8.1 93.6,59.08 93.98,59.46 | 40.42,35.45 40.51,35.53 | 54.93,34.73 54.93,34.96 v54.94,34.98
  Top 0.61: U6.7 104.12,21.61 C15.1 C9.1 107.3,22.14 v107.31,22.12 | U6.10 101.12,21.8 C16.1 99.78,22.14 v99.77,22.12 | R26.2 R28.2 v111.63,18.92 | 106.73,57.43 113.08,57.43 113.13,57.38 113.13,55.75 112.75,56.13 106.48,56.13 105.39,57.23
  Top 1.016: L2.1 93.81,24.47 v93.83,24.46 | R7.1 54.93,34.73 54.13,35.53 41.6,35.53 | 41.6,35.53 40.51,35.53 39.22,35.53 | 39.22,35.53 37.73,35.53 R31.2 | v12.95,36.88 14.74,36.88 | 14.74,36.88 R32.2 | R2.1 39.2,51.07 v39.22,51.05 | R3.1 55.92,51.07 v55.91,51.05 | R27.2 R1.1 24.17,52.29 v25.4,51.05 | 71.09,51.05 v70.28,51.05 70.22,51.12 R4.1 | 71.09,51.05 74.3,51.05 | 74.3,51.05 82.68,59.44 88.98,59.44 U3.2 | 70.41,51.94 74.09,51.94 82.04,59.89 90.42,59.89 90.42,58.85 82.83,58.85 75.03,51.05 74.3,51.05 | 71.09,51.05 70.23,51.92 70.23,53.24 70.64,52.83 75.18,52.83 | 14.74,36.88 16.9,36.88 R22.2 R23.2 21.97,36.89 R24.2 24.11,36.87 | 24.11,36.87 36.2,36.87 R31.2 | R5.1 24.09,36.85 24.11,36.87 | R29.2 36.27,36.95 R31.2 | R30.2 R31.2 | R6.1 40.42,35.45 | 22.84,36.88 24.08,35.64 25.3,36.85 | 39.22,35.53 40.41,34.34 41.6,35.53 | R8.1 70.19,34.96 v70.21,34.98
  Bottom 1.016: v111.63,18.92 108.43,22.12 v107.31,22.12 v99.77,22.12 96.16,22.12 v93.83,24.46 81.84,24.46 76.4,29.9 76.4,33.15 74.57,34.98 v70.21,34.98 v54.94,34.98 | v70.28,51.05 v55.91,51.05 v39.22,51.05 v25.4,51.05 13.36,51.05 11.48,49.17 11.48,38.35 v12.95,36.88
  pour Top: 112.29,51.82 113.31,51.82 113.31,57.35 107.72,57.35 104.8,60.27 82,60.27 82,58.47 103.89,58.47 105.92,56.44 111.53,56.44 112.24,55.73 112.24,51.87
+5V  (via drill 0.3)
  Top 0.254: U2.3 110.36,68.33 109.98,67.94 C6.+ 107.69,62.03 L1.P$2 96.91,62.03 C7.+ 95.85,61.75 91.95,61.75 | U3.3 91.95,61.75 | C5.1 91.82,61.87 91.95,61.75 | U5.14 14.72,47.57 C11.1 | U7.14 28.92,47.57 C12.1 v28.88,49.61
  Top 0.61: USB-TTL.VBUS1 99.15,8.82 v99.14,8.84 | USB-TTL.VBUS2 104.05,8.19 105.03,9.17 C17.1 106.28,9.74 v106.29,9.73
  Top 0.813: 110,64.31 C6.+ | C11.1 v14.71,49.28 | v87.07,61.75 U3.3
  Bottom 0.813: v99.14,8.84 100.03,9.73 v106.29,9.73 108.8,9.73 113.61,14.55 113.61,55.27 v106.86,62.03 | v14.71,49.28 15.04,49.61 v28.88,49.61 74.93,49.61 v87.07,61.75
  pour Top: 112.75,68.71 109.52,68.71 108.56,67.74 108.56,64.29 107.44,63.17 86.61,63.17 86.61,60.99 108.46,60.99 110.46,62.99 110.46,67.64 110.69,67.87 112.75,67.87
+12V
  Top 0.254: U2.1 109.39,70.87 C4.1 104.04,71.79 C3.+ 97.16,72.2 D1.C
  Top 0.813: S7.1 58.25,35.97 55.41,38.8 55.19,38.8 | 55.19,38.8 U4.10 | C10.1 55.19,38.62 55.19,38.8 | 80.09,67.94 81.66,69.52 | 81.66,69.52 83.03,68.15 83.06,68.15 | 81.66,69.52 81.66,70.65 R19.1
  Top 1.016: R19.1 81.6,67.86 81.48,67.74 | S1.1 15.35,58.68 20.24,63.58
  Top 2.54: S8.1 68.26,22.96 61.14,22.96 | 61.14,22.96 58.42,22.96 | 58.42,22.96 55.35,22.96 | 45.52,22.96 42.8,22.96 | 42.8,22.96 40.18,22.96 | 30.3,22.96 27.41,22.96 | 27.41,22.96 12.42,22.96 7.9,27.48 7.9,51.23 20.24,63.58 28.5,63.58 | 28.5,63.58 30.56,63.58 | 30.56,63.58 32.97,63.58 | 44.04,63.58 46.23,63.58 | 46.23,63.58 48.26,63.58 | 59.66,63.58 61.39,63.58 | 61.39,63.58 63.42,63.58 | S5.1 27.45,23 27.41,22.96 | S6.1 42.85,23.01 42.8,22.96 | S7.1 58.25,23.13 58.42,22.96 | S2.1 30.75,63.38 30.56,63.58 | S3.1 46.15,63.5 46.23,63.58 | S4.1 61.55,63.42 61.39,63.58 | D1.C 95.69,72.58 90.86,67.74 81.48,67.74 78.54,67.74 74.37,63.58 67.79,63.58 63.42,63.58 | 24.59,22.99 27.43,25.83 30.3,22.96 | 30.3,22.96 40.18,22.96 | 40.18,22.96 42.85,25.63 45.52,22.96 | 45.52,22.96 55.35,22.96 | 55.35,22.96 58.24,25.86 61.14,22.96 | 28.5,63.58 30.73,61.34 32.97,63.58 | 32.97,63.58 44.04,63.58 | 44.04,63.58 46.15,61.47 48.26,63.58 | 48.26,63.58 59.66,63.58 | 59.66,63.58 61.54,61.7 63.42,63.58
  pour Top: 112.8,70.51 95.63,70.51 95.63,73.84 105.54,73.84 106.98,72.39 112.8,72.39
CLK_NET  (via drill 0.3)
  Top 0.254: U8.5 89.19,32.88 v89.46,32.61 | v101.3,32.61 U1.28
  Bottom 0.254: v89.46,32.61 v101.3,32.61
COM1
  Bottom 2.54: J4.2 21.5,56.8 S1.2
COM2
  Bottom 2.54: J5.2 S2.2
COM3
  Bottom 2.54: 51.98,56.82 S3.2 52.98,57.48 J6.2
COM4
  Bottom 2.54: 67.22,56.98 S4.2 68.22,57.32 J7.2
COM5
  Bottom 2.54: J8.2 21.5,30.3 S5.2
COM6
  Bottom 2.54: J9.2 36.74,30.24 S6.2
COM7
  Bottom 2.54: J10.2 52.98,29.62 S7.2
COM8
  Bottom 2.54: J11.2 68.22,29.78 S8.2
D+  (via drill 0.3)
  Top 0.254: U6.1 101.35,14.35 USB-TTL.A6 101.35,8.28 v101.1,8.53 | USB-TTL.B6 102.35,8.29 v102.59,8.53
  Bottom 0.254: v101.1,8.53 v102.59,8.53
D-
  Top 0.254: USB-TTL.B7 100.85,6.21 101.09,5.97 101.6,5.97 101.85,6.22 USB-TTL.A7 101.85,14.3 U6.2 102.13,14.56
DTR
  Top 0.254: U6.4 104.12,13.48 104.52,13.08 107.19,13.08 R25.1 Q11.2
EMAC_MDC  (via drill 0.3)
  Top 0.254: U1.37 112.73,35.58 111.89,36.42 105.97,36.42 v105.94,36.4 | U8.13 84.46,33.45 v83.82,34.09
  Bottom 0.254: v83.82,34.09 103.63,34.09 v105.94,36.4
EMAC_MDIO  (via drill 0.3)
  Top 0.254: v103.83,35.94 U1.30 | U8.12 85.11,34.6 v84.71,35
  Bottom 0.254: v84.71,35 102.89,35 v103.83,35.94
EMAC_RXD0
  Top 0.254: U1.10 102.56,53.19 101.37,54.38 89.28,54.38 87.86,52.96 87.86,35.51 87.11,34.76 U8.8
EMAC_RXD1
  Top 0.254: U1.11 101.3,53.34 100.86,53.77 89.66,53.77 88.42,52.53 88.42,35.26 87.61,34.45 U8.7
EMAC_RXDV  (via drill 0.3)
  Top 0.254: U1.12 100.03,51.61 v99.62,51.21 | U8.11 85.61,45.99 v85.6,46
  Bottom 0.254: v85.6,46 91.24,46 96.44,51.21 v99.62,51.21
EMAC_TXD0  (via drill 0.3)
  Top 0.254: U8.17 83.48,31.38 v82.5,30.4 | U1.31 v105.11,29.37 v105.11,29.36
  Bottom 0.254: v82.5,30.4 82.5,29.79 82.93,29.36 v105.11,29.36
EMAC_TXD1  (via drill 0.3)
  Top 0.254: U8.18 84.3,30.88 v83.54,30.12 | U1.36 v111.46,30.13 v111.45,30.12
  Bottom 0.254: v111.45,30.12 v83.54,30.12
EMAC_TXEN  (via drill 0.3)
  Top 0.254: U1.33 107.62,34.53 v107.62,28.6 | U8.16 82.88,31.88 v82.47,31.47
  Bottom 0.254: v107.62,28.6 82.73,28.6 81.53,29.79 81.53,31.11 81.89,31.47 v82.47,31.47
GND  (via drill 0.3)
  Top 0.254: USB-TTL.GND2 104.83,7.8 105.82,8.79
  Top 0.61: U1.1 114,54.48 C14.2 114.52,56.76 C2.2 | C2.2 114.52,56.94 113.97,57.48
  other vias: 119.33,15.04 1.68,43 11.56,34.34 13.84,43.21 13.46,41.3 47.78,46.58 90.32,48.77 17.93,45.36 7.32,66.83 4.88,64.14 5.13,41.27 6.25,16.64 29.18,40.97 86.79,40.92 80.26,40.87 85.62,32.87 87.07,32.84 87.1,31.47 86.39,32.11 85.57,31.37 91.44,27.3 95.53,25.93 100.13,26.95 105.59,25.04 109.93,24.97 118.34,12.6 117.96,23.57 106.88,11.56 99.72,3.3 102.64,3.4 85.98,7.62 77.11,21.95 99.19,16.99 98.68,12.24 92.81,2.18 77.6,3.07 93.6,18.21 101.73,17.75 102.9,17.96 104.19,17.93 106.25,17.91 104.44,16.87 103.3,16.74 102.03,16.66 106.93,49.48 109.8,48.21 110.44,41.94 107.52,39.52 110.03,38.38 103.68,43.54 105.97,45.06 108.28,43.99 107.26,41.94 105.66,42.57 100.61,41.43 98.25,44.93 90.7,40.92 93.5,41 90.73,50.9 93.7,52.22 82.07,41.17 85.39,54.08 83.31,48.18 5.87,72.39 92.08,41.17 1.96,39.22 84.12,52.12 90.37,65.33 97.23,56.31 84.02,65.38 91.85,72.36 77.34,72.11 112.8,82.8 119.33,78.82 112.93,78.46 116.05,74.75 118.06,63.65 105.44,80.67 112.73,2.97 115.39,7.06 119.58,7.8 111.71,7.92 103.23,31.88 97.1,31.45 94.87,36.02 80.59,33.93 8.26,3.12 8.51,6.78 3.96,8.38 3.86,12.75 9.42,13.08 4.67,22.28 5.13,32.66 11.61,30.38 4.14,47.42 5.21,55.09 2.57,78.87 6.38,79.73 7.54,85.14 8.86,81.79 9.63,72.62 9.45,63.93 10.62,36.22 1.96,49.94 16.76,44.91 2.01,61.06 7.57,61.19 9.47,57.76 86.54,48.64 86.18,51.92 62.18,47.6 80.26,52.37 82.88,50.75 83.06,53.44 78.49,63.27 80.37,65.58 85.37,49.91 49.4,46.3 27.05,40.13 115.6,11.76 91.74,49.38 81.36,34.77 84.28,41.02 79.48,32.36 77.22,18.08 77.37,10.06 84.66,14.05 87.58,6.15 91.36,15.54 92.99,22.4 89.48,35.97 110.08,22.96 103.1,12.7 116.1,26.11 119.13,26.34 119.33,19.74 115.8,22.02 115.47,61.98 119,61.98 114.99,69.9 114.63,67.61 114.4,64.85 112.9,59.61 101.22,78.79 108.36,81.56 110.62,83.97 110.44,75.72 94.84,65.3 1.8,35.43 2.21,28.63 79.48,34.52 25.4,39.4 28.24,40.11
  pour Bottom (isolate 0.254, rank 6): -6.22,90.04 126.24,90.04 126.24,-2.03 -6.22,-2.03
  pour Top (isolate 0.254, rank 6): -8.51,92.96 128.4,92.96 128.4,-4.19 -8.51,-4.19
IO0  (via drill 0.3)
  Top 0.254: R28.1 Q11.3 v109.98,17.63 | U1.25 97.49,33.3 98.75,32.03 v98.75,19.96
  Top 0.406: U1.25 97.49,41.43 v100.51,44.45
  Bottom 0.254: v98.75,19.96 107.64,19.96 v109.98,17.63
  Bottom 0.406: FLASH.P$1 98.65,79.9 98.65,61.92 100.51,60.07 v100.51,44.45
LED_G
  Top 0.254: U8.3 90.97,31.88 R10.1 R11.2
LED_Y
  Top 0.254: U8.2 89.69,31.38 R9.1
N$1
  Top 0.254: U2.2 106.29,69.6 D3.C 105.66,68.14 L1.P$1
  pour Top: 112.75,70 104.75,70 104.75,68.35 103.25,66.85 100.99,66.85 100.99,65 106.32,65 107.65,66.32 107.65,68.53 108.33,69.22 112.75,69.22
N$2
  Top 0.305: LED1.A R1.2
N$4
  Top 0.254: LED2.A R2.2
N$5
  Top 0.254: LED3.A 54.19,53.29 R3.2
N$6
  Top 0.254: LED4.A R4.2
N$7
  Top 0.305: LED5.A R5.2
N$8
  Top 0.254: R25.2 115,13.84 Q12.1
N$9
  Top 0.254: Q11.1 R15.2
N$11
  Top 0.305: LED6.A R6.2
N$12
  Top 0.254: LED7.A R7.2
N$13
  Top 0.254: LED8.A R8.2
N$14
  Top 0.254: R9.2 95.12,29.97 96.65,28.45 96.65,10.36 94.92,8.64 94.92,4.98 94.28,4.34 92.58,4.34 J3.11
N$15
  Top 0.254: R10.2 94.31,31.75 97.31,28.75 97.31,9.93 95.63,8.26 95.63,4.67 94.56,3.61 82.61,3.61 J3.9
N$17
  Top 0.254: U8.24 87.61,28.36 R13.2
N$18
  Top 0.254: U8.15 83.13,32.38 82.95,32.56 82.81,32.7 | 82.81,32.7 C24.1 | R12.1 82.81,32.7
N$19
  Top 0.254: J1.VIN0 94.76,82.09 D2.C 96.77,80.07 D1.A
  pour Top: 88.65,83.64 96.67,83.64 98.27,82.04 98.27,75.95 94.31,75.95 94.31,78.26 92.68,79.88 88.72,79.88 88.65,79.88
N$20
  Top 0.61: R19.2 LED9.A
N$21
  Top 0.254: USB-TTL.A5 100.35,9.67 R21.2
N$22
  Top 0.254: USB-TTL.B5 103.35,9.79 R20.2
NC1
  Bottom 2.54: J4.3 16.42,71.92 S1.4
NC2
  Bottom 2.54: J5.3 31.66,71.76 S2.4
NC3
  Bottom 2.54: S3.4 46.9,71.6 46.9,82 J6.3
NC4
  Bottom 2.54: J7.3 63.14,72.44 S4.4
NC5
  Bottom 2.54: J8.3 26.58,15.28 S5.4
NC6
  Bottom 2.54: J9.3 41.82,15.12 S6.4
NC7
  Bottom 2.54: J10.3 58.06,15.96 S7.4
NC8
  Bottom 2.54: J11.3 73.3,15.8 S8.4
NO1
  Bottom 2.54: J4.1 26.58,71.62 S1.5
NO2
  Bottom 2.54: S2.5 41.82,71.78 J5.1
NO3
  Bottom 2.54: S3.5 58.15,82.91 J6.1
NO4
  Bottom 2.54: J7.1 73.3,71.1 S4.5
NO5
  Bottom 2.54: J8.1 16.42,15.18 S5.5
NO6
  Bottom 2.54: J9.1 31.66,15.34 S6.5
NO7  (1 unrouted)
  Bottom 2.54: J10.1 47.9,14.51 S7.5
NO8
  Bottom 2.54: J11.1 63.14,14.66 S8.5
O1
  Top 0.305: U4.1 42.78,49 39.67,45.9 31.17,45.9 29.46,44.2 19.33,44.2 18.19,43.05 U5.2
O2
  Top 0.305: U4.2 42.65,47.73 40.21,45.29 31.47,45.29 29.74,43.56 21.44,43.56 20.73,42.85 U5.4
O3
  Top 0.305: U4.3 42.58,46.46 40.82,44.7 31.83,44.7 30.02,42.9 23.52,42.9 23.27,42.65 U5.6
O4  (via drill 0.3)
  Top 0.254: v24.54,46.13 U5.8 | U4.4 44.02,45.19 v44.78,45.95
  Bottom 0.254: v24.54,46.13 24.71,45.95 v44.78,45.95
O5
  Top 0.305: U4.5 43.24,44.12 33.33,44.12 32.49,43.28 U7.2
O6
  Top 0.305: U7.4 35.03,42.88 35.69,43.54 41.81,43.54 42.7,42.65 U4.6
O7
  Top 0.305: U4.7 42.95,41.38 41.35,42.98 37.85,42.98 37.57,42.7 U7.6
O8  (via drill 0.3)
  Top 0.254: U7.8 v39.67,47.62 | v45.09,47.02 45.54,46.56 45.54,45.24 44.88,44.58 44.88,40.66 44.33,40.11 U4.8
  Bottom 0.254: v45.09,47.02 40.28,47.02 v39.67,47.62
RESET  (via drill 0.3)
  Top 0.406: C1.1 111.46,54.49 U1.3 v111.46,50.88 v111.45,50.88 | Q12.3 R26.1 113.16,15.93 v112.42,15.19
  Bottom 0.406: v112.42,15.19 112.42,49.91 v111.45,50.88 99.77,62.56 99.77,83.2 RESET.P$1
REY1  (via drill 0.3)
  Top 0.61: U4.18 50.68,48.96 v47.27,52.38
  Bottom 0.61: v47.27,52.38 30.1,52.38 27.36,55.12 S1.3
REY2
  Top 0.61: S2.3 42.75,55.22 50.27,47.7 53.02,47.7 U4.17
REY3
  Top 0.61: U4.16 55.85,46.42 57.2,47.78 57.2,52.2 58.15,53.15 S3.3
REY4  (via drill 0.3)
  Top 0.61: U4.15 56.35,45.15 58.27,47.07 58.27,51.41 v59.26,52.4
  Bottom 0.61: S4.3 73.55,54.45 72.24,52.4 v59.26,52.4
REY5  (via drill 0.3)
  Top 0.61: U4.14 53.01,43.87 50.88,43.87 47.65,40.64 v47.65,37.8
  Bottom 0.61: S5.3 15.45,32.8 18.14,35.48 45.34,35.48 v47.65,37.8
REY6  (via drill 0.3)
  Top 0.61: U4.13 53.02,42.62 51.1,42.62 49,40.51 v49,37.72
  Bottom 0.61: S6.3 30.85,32.88 32.49,34.52 45.8,34.52 v49,37.72
REY7  (via drill 0.3)
  Top 0.61: U4.12 53.02,41.35 51.44,41.35 50.29,40.21 v50.29,37.49
  Bottom 0.61: S7.3 46.25,33.45 v50.29,37.49
REY8
  Top 0.813: S8.3 61.65,34.31 55.89,40.07 U4.11
RTS
  Top 0.254: U6.6 105.52,20.37 109.09,20.37 | 109.09,20.37 109.45,20.37 | 109.45,20.37 109.86,20.37 | 109.86,20.37 115.11,20.37 116.71,18.77 Q12.2 | R15.1 109.47,19.99 | 109.47,19.99 109.47,20.34 109.45,20.37 | 109.09,20.37 109.47,19.99 | 109.47,19.99 109.86,20.37
RX_N
  Top 0.254: U8.22 86.61,25.8 R18.2 87.81,24.6 87.81,20.72 J3.6
RX_P
  Top 0.254: U8.23 87.11,27.13 R17.2 88.47,25.44 88.47,21.74 89.97,20.24 89.97,19.25 89.31,18.59 86.17,18.59 J3.3
RXD  (via drill 0.3)
  Top 0.254: v103.12,23.65 U6.8 | U1.34 108.92,28.2 107.85,27.13 102.84,27.13 v101.24,25.53
  Bottom 0.254: v101.24,25.53 v103.12,23.65
T1  (via drill 0.3)
  Top 0.254: S9.16 78.59,41.63 v79.78,42.82 | U1.8 105.11,51.54 101.37,47.8 v98.91,47.8 | v13.13,48.54 13.13,50.75 15.67,53.29 LED1.C | R22.1 U5.1 v16.92,42.82
  Bottom 0.254: v98.91,47.8 93.93,42.82 v79.78,42.82 23.93,42.82 22.71,41.6 18.14,41.6 v16.92,42.82 13.13,46.61 v13.13,48.54
T2  (via drill 0.3)
  Top 0.254: S9.15 v76.05,43.61 | U1.9 103.84,51.46 101.45,49.07 v98.75,49.07 | v26.85,47.8 26.85,52.43 27.71,53.29 LED2.C | R23.1 U5.3 v19.46,42.8
  Bottom 0.254: v98.75,49.07 93.29,43.61 v76.05,43.61 23.9,43.61 22.38,42.09 20.17,42.09 v19.46,42.8 19.46,46.08 21.18,47.8 v26.85,47.8
T3  (via drill 0.3)
  Top 0.254: S9.14 v73.51,44.4 | v60.55,46.48 v60.55,44.42 | U1.13 v98.76,50.35 v98.75,50.34 | LED3.C 50.05,52.21 50.67,51.59 54.15,51.59 54.76,50.98 v54.76,47.85 | R24.1 U5.5 v22,42.8
  Bottom 0.254: v98.75,50.34 92.81,44.4 v73.51,44.4 60.58,44.4 v60.55,44.42 23.62,44.42 v22,42.8 | v54.76,47.85 59.18,47.85 v60.55,46.48
T4  (via drill 0.3)
  Top 0.254: U1.16 94.61,48.01 v94.59,47.98 | S9.13 v70.97,45.19 | R27.1 23.27,50.51 U5.9 v23.27,46.13 | LED4.C 64.58,46.69 v64.57,46.67
  Bottom 0.254: v94.59,47.98 91.8,45.19 v70.97,45.19 64.97,45.19 | 64.97,45.19 64.49,45.19 | v64.57,46.67 64.57,45.59 | 64.57,45.59 64.57,45.26 64.49,45.19 | 64.16,45.19 64.57,45.59 | 64.57,45.59 64.97,45.19 | 64.49,45.19 24.21,45.19 v23.27,46.13
T5  (via drill 0.3)
  Top 0.254: R29.1 31.23,38.81 31.22,38.83 v31.22,39.93 U7.1 | U1.23 95,39.12 v94.46,38.58 | S9.12 v68.43,38.58 | LED5.C 14.99,33.73 v14.5,34.21
  Bottom 0.254: v94.46,38.58 v68.43,38.58 59,38.58 56.26,41.33 32.61,41.33 v31.22,39.93 28.57,37.29 17.58,37.29 v14.5,34.21
T6  (via drill 0.3)
  Top 0.254: U7.3 v33.76,39.85 | v33.76,39.85 R30.1 33.77,38.68 33.76,38.7 v33.76,39.85 | S9.11 v65.89,37.77 | U1.26 v98.76,37.77 v98.75,37.77 | LED6.C 25.93,33.71 24.84,32.61 14.58,32.61 v14.4,32.79
  Bottom 0.254: v98.75,37.77 v65.89,37.77 58.75,37.77 55.8,40.72 34.62,40.72 v33.76,39.85 30.25,36.35 17.96,36.35 v14.4,32.79
T7  (via drill 0.3)
  Top 0.254: R31.1 v36.3,39.93 U7.5 | S9.10 v63.35,36.98 | U1.27 100.03,36.88 v100.18,37.03 | v48.41,33.71 LED7.C
  Bottom 0.254: v100.18,37.03 100.13,36.98 v63.35,36.98 58.37,36.98 55.42,39.93 v51.41,39.93 | v36.3,39.93 v51.41,39.93 | v51.41,39.93 51.41,36.7 v48.41,33.71
T8  (via drill 0.3)
  Top 0.254: U1.29 102.57,38.76 v102.59,38.79 | S9.9 60.81,39.45 | v14.76,39.93 R32.1 | LED8.C 64.08,33.68 60.81,36.96 60.81,39.45 | 60.81,39.45 59.51,39.45 v59.5,39.43 | U7.9 37.57,49.28 38.23,49.94 45.44,49.94 46.08,49.3 46.08,42.43 v45.7,42.05
  Bottom 0.254: v102.59,38.79 101.96,39.42 60.81,39.42 v59.5,39.43 56.92,42.01 45.73,42.01 | 45.73,42.01 24,42.01 23.04,41.05 15.88,41.05 v14.76,39.93 | 45.73,42.01 v45.7,42.05
TX_N
  Top 0.254: J3.2 83.61,25.6 83.58,25.58 R16.2 85.61,27.94 U8.20
TX_P
  Top 0.254: J3.1 83.01,17.3 84.91,19.2 84.91,20.75 84.2,21.46 84.2,24.73 84.37,24.9 84.81,25.34 | R14.2 84.81,25.34 | U8.21 86.11,27.61 84.81,26.31 84.81,25.34
TXD
  Top 0.254: U6.9 102.12,24.53 103.53,25.93 108.13,25.93 110.19,28 U1.35
VCC  (via drill 0.3)  (1 unrouted)
  Top 0.254: U8.19 83.92,29.03 C19.1 | 81.55,23 v81.53,22.99 | 90.35,25.59 R17.1 | U8.9 v86.61,36.04 | v86.61,36.04 | v86.61,36.04 C18.1 | 85.11,30.28 85.11,29.11 84.3,28.3 82.6,28.3 81.74,27.43 81.74,28.14 | 84.78,29.39 84.78,29.67 85.01,29.9 | U8.1 88.63,30.51 90.44,28.7
  Top 0.813: R14.1 R18.1 86.15,23.27 J3.4 | v90.35,22.96 90.35,25.59 90.36,25.58 L2.2 92.11,26.05 92.69,26.62 92.69,27.29 C20.1 92.67,28.03 92.13,28.57 90.57,28.57 88.63,30.51 | 81.55,23 R16.1 C21.1 C19.1 81.55,29.55 80.92,30.18 R12.2 80.91,31.01 v77.98,31.01 | 81.74,28.14 81.79,28.14 82.35,28.7 84.1,28.7 84.78,29.39
  Bottom 0.813: v77.98,31.01 77.98,35.15 78.87,36.04 v86.61,36.04 | J3.12 87.42,12.04 J3.5 87.43,18.19 86.15,19.46 J3.4 86.15,22.77 85.95,22.96 | v90.35,22.96 85.95,22.96 | 85.95,22.96 81.56,22.96 v81.53,22.99
VDDCR
  Top 0.254: U8.6 89.55,33.38 C22.1 C23.1

### Text on the board
tPlace: www.makerfabs.com | Home Assistant Relay 8 Channel V1.2
bPlace: DC12V